# Altium schematic sheet schema3.SchDoc
size A4
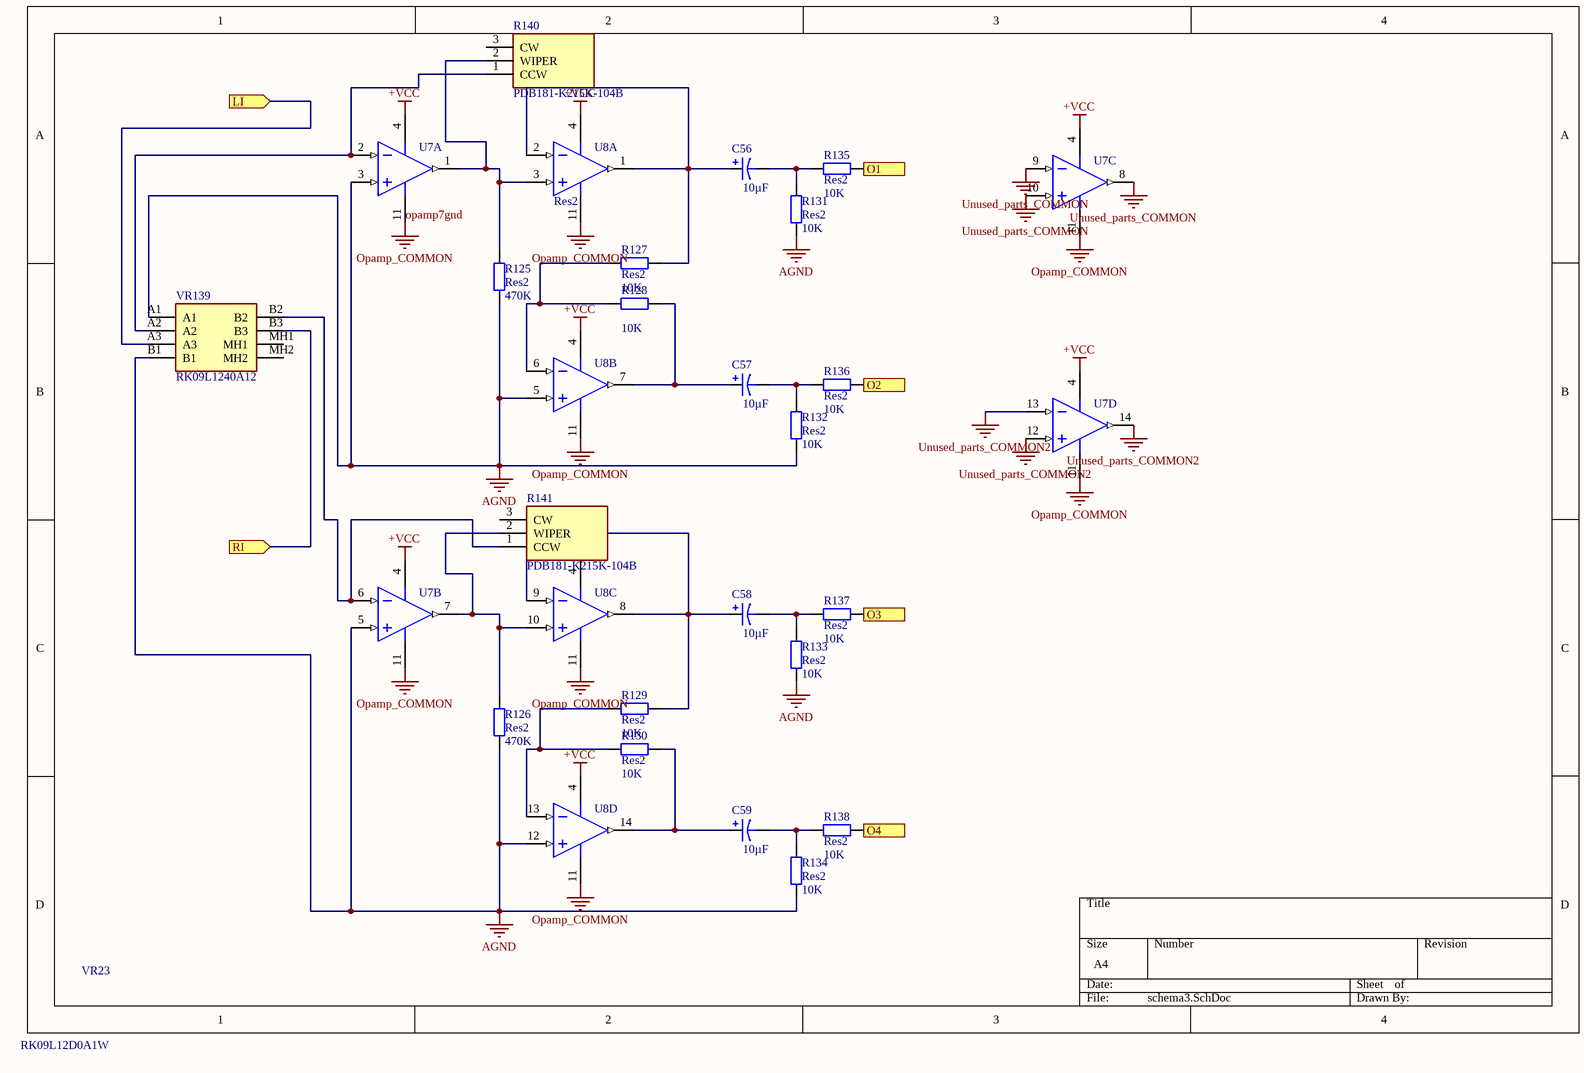
[diagram p0: schema3.SchDoc]

## Parts
C56  value 10µF  [SMD_POLAR_CAPACITOR]  (hidden comment: Cap Pol1)
C57  value 10µF  [SMD_POLAR_CAPACITOR]  (hidden comment: Cap Pol1)
C58  value 10µF  [SMD_POLAR_CAPACITOR]  (hidden comment: Cap Pol1)
C59  value 10µF  [SMD_POLAR_CAPACITOR]  (hidden comment: Cap Pol1)
R125  Res2  value 470K  [SMD_RESISTOR]
R126  Res2  value 470K  [SMD_RESISTOR]
R127  Res2  value 10K  [SMD_RESISTOR]
R128  Res2  value 10K  [SMD_RESISTOR]
R129  Res2  value 10K  [SMD_RESISTOR]
R130  Res2  value 10K  [SMD_RESISTOR]
R131  Res2  value 10K  [SMD_RESISTOR]
R132  Res2  value 10K  [SMD_RESISTOR]
R133  Res2  value 10K  [SMD_RESISTOR]
R134  Res2  value 10K  [SMD_RESISTOR]
R135  Res2  value 10K  [SMD_RESISTOR]
R136  Res2  value 10K  [SMD_RESISTOR]
R137  Res2  value 10K  [SMD_RESISTOR]
R138  Res2  value 10K  [SMD_RESISTOR]
R140  PDB181-K215K-104B  [PDB181K220K104B]
R141  PDB181-K215K-104B  [PDB181K220K104B]
U7  OPA1664AIDR  [OPA1664AIDR]  (value not drawn)  (parts A,B,C,D of 4)
U8  OPA1664AIDR  [OPA1664AIDR]  (value not drawn)  (parts A,B,C,D of 4)
VR23  RK09L12D0A1W  [RK09L12D0A1W]
VR139  RK09L1240A12  [RK09L124A12]

## Ports
LI (in), O1 (out), O2 (out), O3 (out), O4 (out), RI (in)

## Nets
+VCC: U7.4(V+) U8.4(V+)
AGND: R125.1 R126.1 R131.1 R132.1 R133.1 R134.1 U7.3(IN_A+) U7.5(IN_B+) U8.5(IN_B+) U8.12(IN_D+) VR139.A1 VR139.B1
opamp7gnd: U7.11(V-) U8.11(V-)  [also labelled Opamp_COMMON]
Unused_parts_COMMON: U7.8(OUT_C) U7.9(IN_C-) U7.10(IN_C+)
Unused_parts_COMMON2: U7.12(IN_D+) U7.13(IN_D-) U7.14(OUT_D)
LI: VR139.A3 ; port LI
O1: R135.2 ; port O1
O2: R136.2 ; port O2
O3: R137.2 ; port O3
O4: R138.2 ; port O4
RI: VR139.B3 ; port RI
NetC56_1: C56.1 R127.2 U8.1(OUT_A) U8.2(IN_A-)
NetC56_2: C56.2 R131.2 R135.1
NetC57_1: C57.1 R128.2 U8.7(OUT_B)
NetC57_2: C57.2 R132.2 R136.1
NetC58_1: C58.1 R129.2 U8.8(OUT_C) U8.9(IN_C-)
NetC58_2: C58.2 R133.2 R137.1
NetC59_1: C59.1 R130.2 U8.14(OUT_D)
NetC59_2: C59.2 R134.2 R138.1
NetR125_2: R125.2 R140.2(WIPER) U7.1(OUT_A) U8.3(IN_A+)
NetR126_2: R126.2 R141.2(WIPER) U7.7(OUT_B) U8.10(IN_C+)
NetR127_1: R127.1 R128.1 U8.6(IN_B-)
NetR129_1: R129.1 R130.1 U8.13(IN_D-)
NetR140_1: R140.1(CCW) U7.2(IN_A-) VR139.A2
NetR141_1: R141.1(CCW) U7.6(IN_B-) VR139.B2

Not connected (* = marked no-connect by the designer): R140 3(CW); R141 3(CW); VR139 MH1 MH2

## Library data of the parts
C56-C59 = Cap Pol1: Polarized Capacitor (Radial); Published: 8-Jun-2000; LatestRevisionDate: 17-Jul-2002; LatestRevisionNote: Re-released for DXP Platform.; PackageReference: RB7.6-15; Publisher: Altium Limited; PackageDescription: Polarized Capacitor (Radial); 2 Leads
R125-R138 = Res2: Resistor; Published: 8-Jun-2000; LatestRevisionDate: 17-Jul-2002; LatestRevisionNote: Re-released for DXP Platform.; PackageReference: AXIAL-0.4; Publisher: Altium Limited; PackageDescription: Axial Device, Thru-Hole; 2 Leads; 0.4 in Pin Spacing
R140 R141 = PDB181-K215K-104B: Variable Resistor; Manufacturer_Name: Bourns; Height: 16.5mm; Manufacturer_Part_Number: PDB181-K215K-104B
U7 U8 = CMP-0272-00211-3: Sound Plus Low-Power, Low-Noise and Distortion, Audio Operational Amplifier, 3 to 36 V, -40 to 85 degC, 14-pin SOIC (D14), Green (RoHS & no Sb/Br); Manufacturer: Texas Instruments; Iq per channel(Max)(mA): 1.5; IIB(Max)(pA): 1200000; Offset Drift(Typ)(uV/C): 2; Total Supply Voltage(Max)(+5V is 5, +/-5V is 10): 36; Rating: Catalog; Packing: LARGE T&R; Slew Rate(Typ)(V/us): 17; CMRR(Min)(dB): 106; Total Supply Voltage(Min)(+5V is 5, +/-5V is 10): 3; Sub Family: Audio Operational Amplifier, High Supply Voltage Amplifier (>=30V), Low Noise Amp (<=10nV/rtHz), Precision Amplifier; GBW(Typ)(MHz): 22; Number of Channels: 4; Code_JEDEC: MS-012; PartNumber: OPA1664AIDR; ComponentLink2Description: Datasheet; ComponentLink3URL: http://www.ti.com/lit/ml/mpds177g/mpds177g.pdf; PackageVersion: 4040047-5/M, 06/2011; ComponentLink1Description: Manufacturer URL; DatasheetVersion: SBOS489; Mounting Technology: Surface Mount; Vio (25C)(Max)(mV): 1.5; PackageReference: D0014A; ComponentLink1URL: http://www.ti.com/; ComponentLink2URL: http://www.ti.com/lit/ds/symlink/opa1664.pdf; Eco-Plan: Green (RoHS & no Sb/Br); PackageDescription: 14-Pin Plastic Small Outline, Body 8.65 x 3.9 mm, Pitch 1.27 mm; ComponentLink3Description: Package Specification
VR23 = RK09L12D0A1W: Variable Resistor; Manufacturer_Name: ALPS; Datasheet Link: https://componentsearchengine.com/Datasheets/1/RK09L12D0A1W.pdf; Height: 25mm; Mouser2 Part Number: 688-RK09L12D0A1W; Mouser2 Price/Stock: https://www.mouser.com/Search/Refine.aspx?Keyword=688-RK09L12D0A1W; Manufacturer_Part_Number: RK09L12D0A1W
VR139 = RK09L1240A12: Variable Resistor; Manufacturer_Name: ALPS; Datasheet Link: https://componentsearchengine.com/Datasheets/1/RK09L1240A12.pdf; Height: 30mm; Mouser2 Part Number: 688-RK09L1240A12; Mouser2 Price/Stock: https://www.mouser.com/Search/Refine.aspx?Keyword=688-RK09L1240A12; Manufacturer_Part_Number: RK09L1240A12